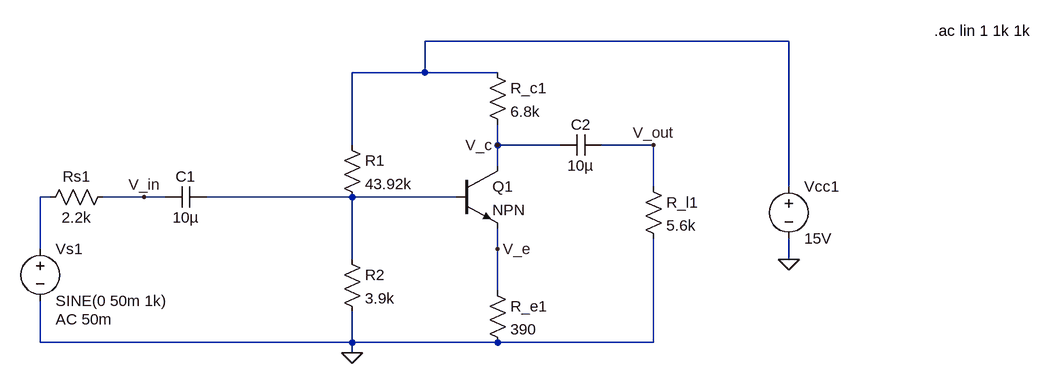
[diagram p0: schematic R_input_and_gain.asc]
R_input_and_gain.asc, the LTspice schematic file:
Version 4
SHEET 1 988 680
WIRE 608 -112 48 -112
WIRE 48 -64 48 -112
WIRE 48 -64 -64 -64
WIRE 160 -64 48 -64
WIRE -64 48 -64 -64
WIRE 160 48 160 16
WIRE 256 48 160 48
WIRE 400 48 320 48
WIRE 160 80 160 48
WIRE 400 112 400 48
WIRE 608 112 608 -112
WIRE -528 128 -544 128
WIRE -384 128 -448 128
WIRE -352 128 -384 128
WIRE -64 128 -288 128
WIRE 96 128 -64 128
WIRE -544 208 -544 128
WIRE 160 208 160 176
WIRE -64 224 -64 128
WIRE 608 224 608 192
WIRE 160 272 160 208
WIRE -544 352 -544 288
WIRE -64 352 -64 304
WIRE -64 352 -544 352
WIRE 160 352 -64 352
WIRE 400 352 400 192
WIRE 400 352 160 352
WIRE -64 368 -64 352
FLAG -64 368 0
FLAG 608 224 0
FLAG 160 48 V_c
FLAG 160 208 V_e
FLAG -384 128 V_in
FLAG 400 48 V_out
SYMBOL npn 96 80 R0
SYMATTR InstName Q1
SYMBOL res 144 -80 R0
SYMATTR InstName R_c1
SYMATTR Value 6.8k
SYMBOL res -80 32 R0
SYMATTR InstName R1
SYMATTR Value 43.92k
SYMBOL res -80 208 R0
SYMATTR InstName R2
SYMATTR Value 3.9k
SYMBOL res 144 256 R0
SYMATTR InstName R_e1
SYMATTR Value 390
SYMBOL res 384 96 R0
SYMATTR InstName R_l1
SYMATTR Value 5.6k
SYMBOL res -432 112 R90
WINDOW 0 0 56 VBottom 2
WINDOW 3 32 56 VTop 2
SYMATTR InstName Rs1
SYMATTR Value 2.2k
SYMBOL cap -288 112 R90
WINDOW 0 0 32 VBottom 2
WINDOW 3 32 32 VTop 2
SYMATTR InstName C1
SYMATTR Value 10µ
SYMBOL cap 256 64 R270
WINDOW 0 32 32 VTop 2
WINDOW 3 0 32 VBottom 2
SYMATTR InstName C2
SYMATTR Value 10µ
SYMBOL voltage -544 192 R0
WINDOW 123 24 124 Left 2
WINDOW 39 0 0 Left 0
SYMATTR Value2 AC 50m
SYMATTR InstName Vs1
SYMATTR Value SINE(0 50m 1k)
SYMBOL voltage 608 96 R0
WINDOW 123 0 0 Left 0
WINDOW 39 0 0 Left 0
SYMATTR InstName Vcc1
SYMATTR Value 15V
TEXT 832 -128 Left 2 !.ac lin 1 1k 1k

The netlist it stands for:
* R_input_and_gain.asc
Q1 V_c N003 V_e 0 NPN
R_c1 N001 V_c 6.8k
R1 N001 N003 43.92k
R2 N003 0 3.9k
R_e1 V_e 0 390
R_l1 V_out 0 5.6k
Rs1 V_in N002 2.2k
C1 N003 V_in 10µ
C2 V_c V_out 10µ
Vs1 N002 0 SINE(0 50m 1k) AC 50m
Vcc1 N001 0 15V
.model NPN NPN
.model PNP PNP
.lib standard.bjt
.ac lin 1 1k 1k
.backanno
.end